# Altium schematic sheet RS485 channel.SchDoc
size A4
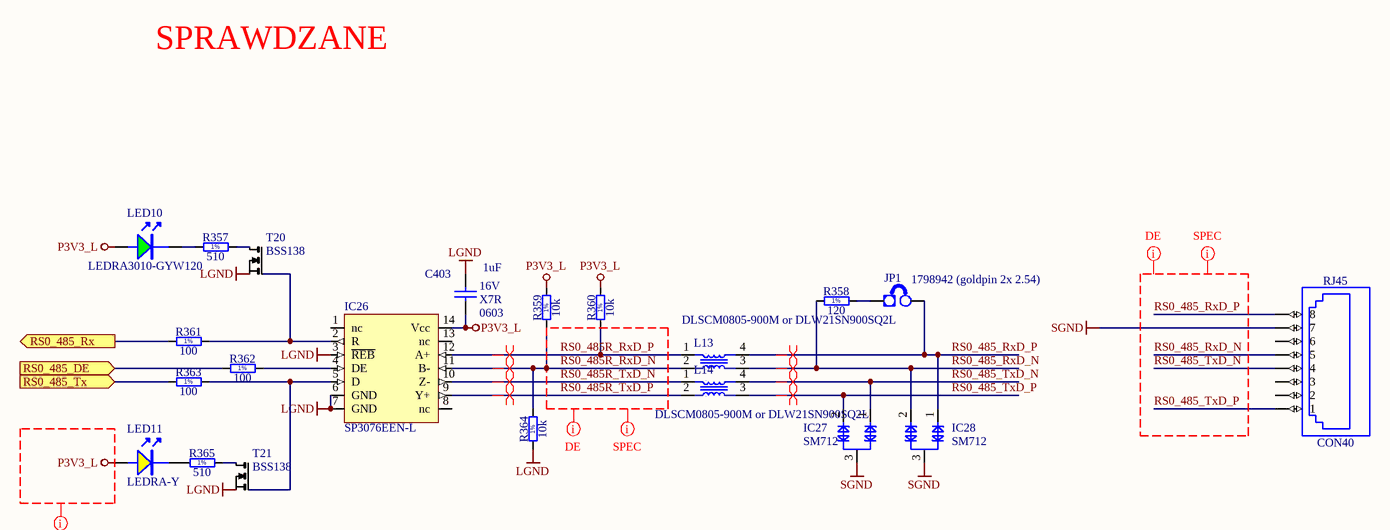
[diagram p0: RS485 channel.SchDoc]

## Parts
C403  1uF  Voltage: 16V  TC: X7R  Case: 0603  [CAPC1608X87N]
CON40  RJ45  [FCI_54602-908LF]
IC26  SP3076EEN-L  [SO-14]
IC27  SM712  [SOT-23]
IC28  SM712  [SOT-23]
JP1  1798942 (goldpin 2x 2.54)  [jump]
L13  DLSCM0805-900M or DLW21SN900SQ2L  [DLSCM0805]
L14  DLSCM0805-900M or DLW21SN900SQ2L  [DLSCM0805]
LED10  LEDRA3010-GYW120  [LED_KPA3010_G]
LED11  LEDRA-Y  [LED_KPA3010_Y]
R357  510  [RESC1608X55N]
R358  120  [RESC3216X65N]
R359  10k  [RESC1005X40N]
R360  10k  [RESC1005X40N]
R361  100  [RESC1005X40N]
R362  100  [RESC1005X40N]
R363  100  [RESC1005X40N]
R364  10k  [RESC1005X40N]
R365  510  [RESC1608X55N]
T20  BSS138  [SOT-23]
T21  BSS138  [SOT-23]

## Ports
RS0_485_DE (in), RS0_485_Rx (out), RS0_485_Tx (in)

## Nets
LGND: C403.2 IC26.3(~{REB}) IC26.6(GND) IC26.7(GND) R364.1 T20.2(S) T21.2(S)
P3V3_L: C403.1 IC26.14(Vcc) LED10.A LED11.A R359.2 R360.2
SGND: CON40.7 IC27.3 IC28.3
RS0_485_DE: R362.1 ; port RS0_485_DE
RS0_485_Rx: R361.1 ; port RS0_485_Rx
RS0_485_RxD_N: CON40.5 IC28.2 L13.3 R358.1
RS0_485_RxD_P: CON40.8 IC28.1 JP1.2(E2) L13.4
RS0_485_Tx: R363.1 ; port RS0_485_Tx
RS0_485_TxD_N: CON40.4 IC27.1 L14.4
RS0_485_TxD_P: CON40.1 IC27.2 L14.3
RS0_485R_RxD_N: IC26.11(B-) L13.2 R359.1 R364.2
RS0_485R_RxD_P: IC26.12(A+) L13.1 R360.1
RS0_485R_TxD_N: IC26.10(Z-) L14.1
RS0_485R_TxD_P: IC26.9(Y+) L14.2
NetIC26_2: IC26.2(R) R361.2 T20.1(G)
NetIC26_4: IC26.4(DE) R362.2
NetIC26_5: IC26.5(D) R363.2 T21.1(G)
NetJP1_1: JP1.1(E1) R358.2
NetLED10_K: LED10.K R357.1
NetLED11_K: LED11.K R365.1
NetR357_2: R357.2 T20.3(D)
NetR365_2: R365.2 T21.3(D)

Not connected (* = marked no-connect by the designer): CON40 2 3 6; IC26 1(nc) 8(nc) 13(nc)

## Layout directives
differential pair: RS0_485_RxD_N, RS0_485_RxD_P, RS0_485_TxD_N, RS0_485_TxD_P, RS0_485R_RxD_N, RS0_485R_RxD_P, RS0_485R_TxD_N, RS0_485R_TxD_P
net class DE: RS0_485_RxD_N, RS0_485_RxD_P, RS0_485_TxD_N, RS0_485_TxD_P, RS0_485R_RxD_N, RS0_485R_RxD_P, RS0_485R_TxD_N, RS0_485R_TxD_P
net class SPEC: RS0_485_RxD_N, RS0_485_RxD_P, RS0_485_TxD_N, RS0_485_TxD_P, RS0_485R_RxD_N, RS0_485R_RxD_P, RS0_485R_TxD_N, RS0_485R_TxD_P
net class POWER: P3V3_L

## Notes on the sheet
- SPRAWDZANE
- (in symbol R0402_10K_1%_0.0625W_100PPM) 1%
- (in symbol R0402_100R_1%_0.0625W_100PPM) 1%
- (in symbol R0603_510R_1%_0.1W_100PPM) 1%
- (in symbol R1206_120R_1%_0.25W_100PPM) 1%

## Library data of the parts
C403 = CC0603_1UF_16V_10%_X7R: Non-polarised capacitor; Part Description: SMD Multilayer Chip Ceramic Capacitor; Manufacturer: GENERIC; Manufacturer1 Part Number: 223824613663; Tolerance: ±10%; Table: Capacitors SMD; Part Number: CC0603_1UF_16V_10%_X7R; Component Kind: Standard; Component Type: Standard; Pin Count: 2; Value: 1uF; Status: Preferred; Manufacturer Part Number: CC0603_1uF_16V_10%_X7R; Mounted: Yes; Socket: No; SMD: Yes; Manufacturer1 Example: PHYCOMP; Manufacturer1 ComponentHeight: 0.87mm; HelpURL: \\cern.ch\dfs\Applications\Altium\Datasheets\CC0805_X5R_PHYCOMP_HC.pdf; Author: CERN DEM JLC; CreateDate: 12/3/2007; LatestRevisionDate: 12/3/2007
CON40 = FCI_54602-908LF: 1 Port, 8 Positions, CAT3 RJ45 Horizontal Modular Jack; Manufacturer: FCI; Part Number: FCI_54602-908LF; Component Kind: Standard; Component Type: Standard; Pin Count: 8; Family: RJ45; Mounted: Yes; Socket: No; SMD: No; Status: None; Part Description: 1 Port, 8 Positions, CAT3 RJ45 Horizontal Modular Jack; Manufacturer Part Number: 54602-908LF; ComponentHeight: 10.43mm; HelpURL: \\cern.ch\dfs\Applications\Altium\Datasheets\FCI_54602-908LF.pdf; Author: CERN DEM JLC; CreateDate: 2013-01-28; LatestRevisionDate: 2013-01-28; Table: FCI
IC26 = DRV_SP3070/73/76: 3.3V, 1/8 Load, Failsafe  RS-485/RS422 Transceivers
IC27 IC28 = D_TVS_SM712: Asymmetrical TVS Diode for RS485
JP1 = JUMPER: Supplier 1: Farnell; Supplier Part Number 1: 1798942
L13 L14 = L_CMC_DLSCM0805_90R: Common Mode Choke 90R
LED10 = LED_SMD_90deg_G: LED (Maritex); Supplier 1: Farnell; Supplier Part Number 1: 8530335RL
LED11 = LED_SMD_90deg_Y: LED (maritex); Supplier 1: Farnell; Supplier Part Number 1: 8530343
R357 R365 = R0603_510R_1%_0.1W_100PPM: Resistor - 1%; Part Description: General Purpose Thick Film Chip Resistor; Manufacturer: GENERIC; Manufacturer1 Part Number: NRC06F5100TRF; Power: 0.1W; TC: ±100ppm/°C; Table: Resistors SMD; Part Number: R0603_510R_1%_0.1W_100PPM; Component Kind: Standard; Component Type: Standard; Pin Count: 2; Value: 510; Status: Preferred; Tolerance: ±1%; Manufacturer Part Number: R0603_510R_1%_0.1W_100PPM; Case: 0603; Mounted: Yes; Socket: No; SMD: Yes; Manufacturer1 Example: NIC COMPONENT; Manufacturer1 ComponentHeight: 0.55mm; HelpURL: \\cern.ch\dfs\Applications\Altium\Datasheets\R0603_NIC_NRC.pdf; Author: CERN DEM JLC; CreateDate: 2007-12-03; LatestRevisionDate: 2008-03-13
R358 = R1206_120R_1%_0.25W_100PPM: Resistor - 1%; Part Description: General Purpose Thick Film Chip Resistor; Manufacturer: GENERIC; Manufacturer1 Part Number: NRC12F1200TRF; Power: 0.25W; TC: ±100ppm/°C; Table: Resistors SMD; Part Number: R1206_120R_1%_0.25W_100PPM; Component Kind: Standard; Component Type: Standard; Pin Count: 2; Value: 120; Status: Preferred; Tolerance: ±1%; Manufacturer Part Number: R1206_120R_1%_0.25W_100PPM; Case: 1206; Mounted: Yes; Socket: No; SMD: Yes; Manufacturer1 Example: NIC COMPONENT; Manufacturer1 ComponentHeight: 0.65mm; HelpURL: \\cern.ch\dfs\Applications\Altium\Datasheets\R1206_NIC_NRC.pdf; Author: CERN DEM JLC; CreateDate: 2007-12-03; LatestRevisionDate: 2008-03-13
R359 R360 R364 = R0402_10K_1%_0.0625W_100PPM: Resistor - 1%; Part Description: General Purpose Thick Film Chip Resistor; Manufacturer: GENERIC; Manufacturer1 Part Number: 232270671003L; TC: ±100ppm/°C; Table: Resistors SMD; Part Number: R0402_10K_1%_0.0625W_100PPM; Component Kind: Standard; Component Type: Standard; Pin Count: 2; Value: 10k; Status: Not recommended; Power: 0.0625W; Tolerance: ±1%; Manufacturer Part Number: R0402_10K_1%_0.0625W_100PPM; Case: 0402; Mounted: Yes; Socket: No; SMD: Yes; Manufacturer1 Example: YAGEO PHYCOMP; Manufacturer1 ComponentHeight: 0.4mm; HelpURL: \\cern.ch\dfs\Applications\Altium\Datasheets\R0402_Phycomp_RC0402.pdf; Author: CERN DEM JLC; CreateDate: 2007-12-03; LatestRevisionDate: 2012-10-17
R361-R363 = R0402_100R_1%_0.0625W_100PPM: Resistor - 1%; Part Description: General Purpose Thick Film Chip Resistor; Manufacturer: GENERIC; Manufacturer1 Part Number: 232270671001L; TC: ±100ppm/°C; Table: Resistors SMD; Part Number: R0402_100R_1%_0.0625W_100PPM; Component Kind: Standard; Component Type: Standard; Pin Count: 2; Value: 100; Status: Not recommended; Power: 0.0625W; Tolerance: ±1%; Manufacturer Part Number: R0402_100R_1%_0.0625W_100PPM; Case: 0402; Mounted: Yes; Socket: No; SMD: Yes; Manufacturer1 Example: YAGEO PHYCOMP; Manufacturer1 ComponentHeight: 0.4mm; HelpURL: \\cern.ch\dfs\Applications\Altium\Datasheets\R0402_Phycomp_RC0402.pdf; Author: CERN DEM JLC; CreateDate: 2007-12-03; LatestRevisionDate: 2012-10-17
T20 T21 = Q_BSS138